# EAGLE schematic SECDONGL_001 (EAGLE 7.7.0)

## Sheet 1 of 3
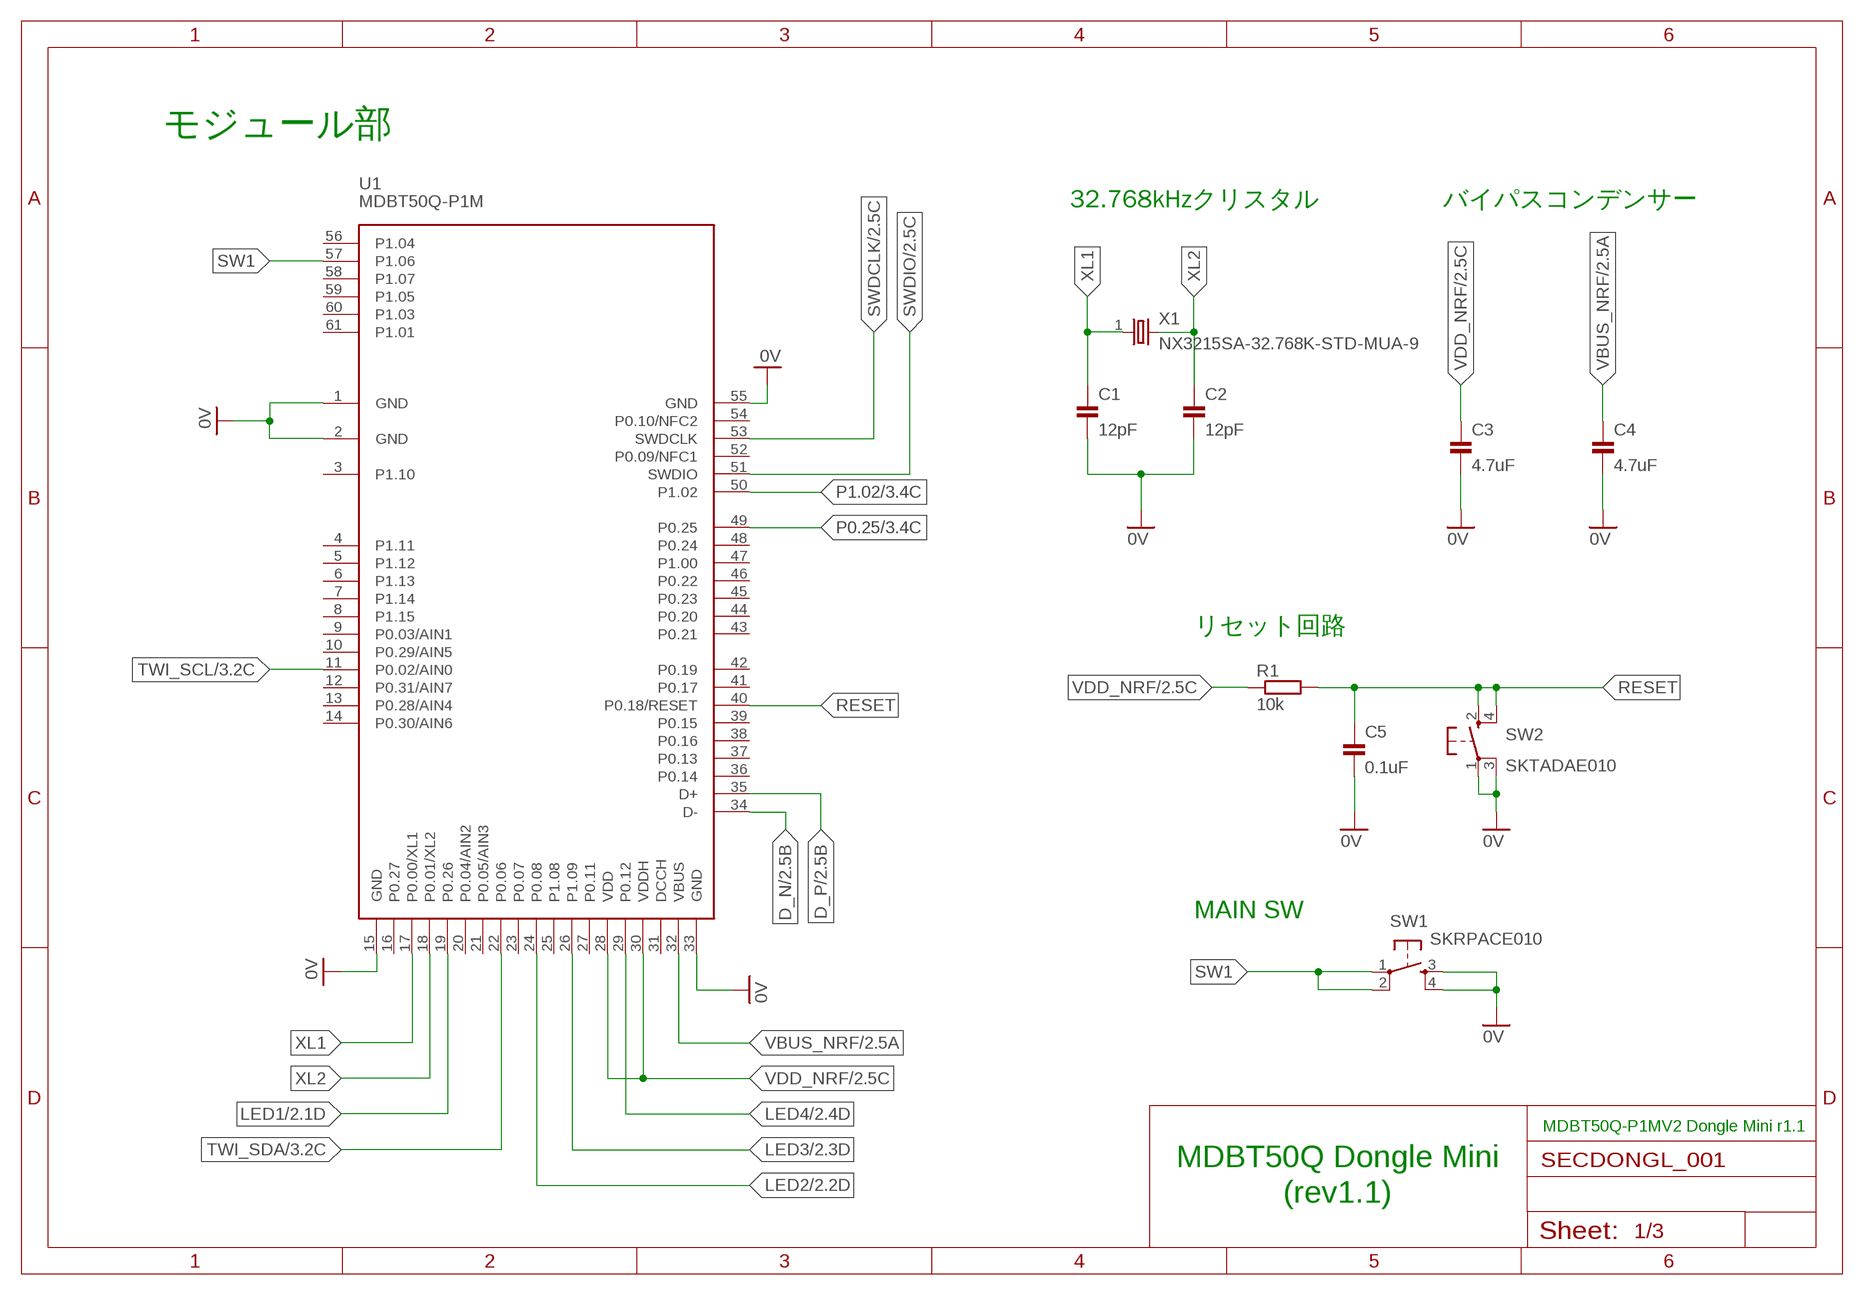
[diagram p0: schematic, sheet 1]

### Parts
C1  12pF  CAP_0603  [C0603K]
C2  12pF  CAP_0603  [C0603K]
C3  4.7uF  CAP_0603  [C0603K]
C4  4.7uF  CAP_0603  [C0603K]
C5  0.1uF  CAP_0402K  [C0402K]
R1  10k  RESISTOR_0402  [R0402]
SW1  SKRPACE010  [SKRPACE010]
SW2  SKTADAE010  [SKTADAE010]
U1  MDBT50Q-P1M  [MDBT50Q-P1M]
X1  NX3215SA-32.768K-STD-MUA-9  [NX3215]

### Nets
0V: C1.2 C2.2 C3.2 C4.2 C5.2 SW1.3(S) SW1.4(S1) SW2.1(P) SW2.3(P1) U1.1(GND) U1.2(GND) U1.15(GND) U1.33(GND) U1.55(GND) ; also sheet 2,3
D_N: U1.34(D-) ; also sheet 2
D_P: U1.35(D+) ; also sheet 2
LED1: U1.19(P0.26) ; also sheet 2
LED2: U1.24(P0.08) ; also sheet 2
LED3: U1.26(P1.09) ; also sheet 2
LED4: U1.29(P0.12) ; also sheet 2
P0.25: U1.49(P0.25) ; also sheet 3
P1.02: U1.50(P1.02) ; also sheet 3
RESET: C5.1 R1.2 SW2.2(S) SW2.4(S1) U1.40(P0.18/RESET)
SW1: SW1.1(P) SW1.2(P1) U1.57(P1.06)
SWDCLK: U1.53(SWDCLK) ; also sheet 2
SWDIO: U1.51(SWDIO) ; also sheet 2
TWI_SCL: U1.11(P0.02/AIN0) ; also sheet 3
TWI_SDA: U1.22(P0.06) ; also sheet 3
VBUS_NRF: C4.1 U1.32(VBUS) ; also sheet 2,3
VDD_NRF: C3.1 R1.1 U1.28(VDD) U1.30(VDDH) ; also sheet 2,3
XL1: C1.1 U1.17(P0.00/XL1) X1.1
XL2: C2.1 U1.18(P0.01/XL2) X1.2
Unconnected: U1.3(P1.10) U1.4(P1.11) U1.5(P1.12) U1.6(P1.13) U1.7(P1.14) U1.8(P1.15) U1.9(P0.03/AIN1) U1.10(P0.29/AIN5) U1.12(P0.31/AIN7) U1.13(P0.28/AIN4) U1.14(P0.30/AIN6) U1.16(P0.27) U1.20(P0.04/AIN2) U1.21(P0.05/AIN3) U1.23(P0.07) U1.25(P1.08) U1.27(P0.11) U1.31(DCCH) U1.36(P0.14) U1.37(P0.13) U1.38(P0.16) U1.39(P0.15) U1.41(P0.17) U1.42(P0.19) U1.43(P0.21) U1.44(P0.20) U1.45(P0.23) U1.46(P0.22) U1.47(P1.00) U1.48(P0.24) U1.52(P0.09/NFC1) U1.54(P0.10/NFC2) U1.56(P1.04) U1.58(P1.07) U1.59(P1.05) U1.60(P1.03) U1.61(P1.01)

### Notes on the sheet
- モジュール部
- 32.768kHzクリスタル | バイパスコンデンサー
- リセット回路
- MAIN SW
- MDBT50Q-P1MV2 Dongle Mini r1.1
- MDBT50Q Dongle Mini
- (rev1.1)

## Sheet 2 of 3
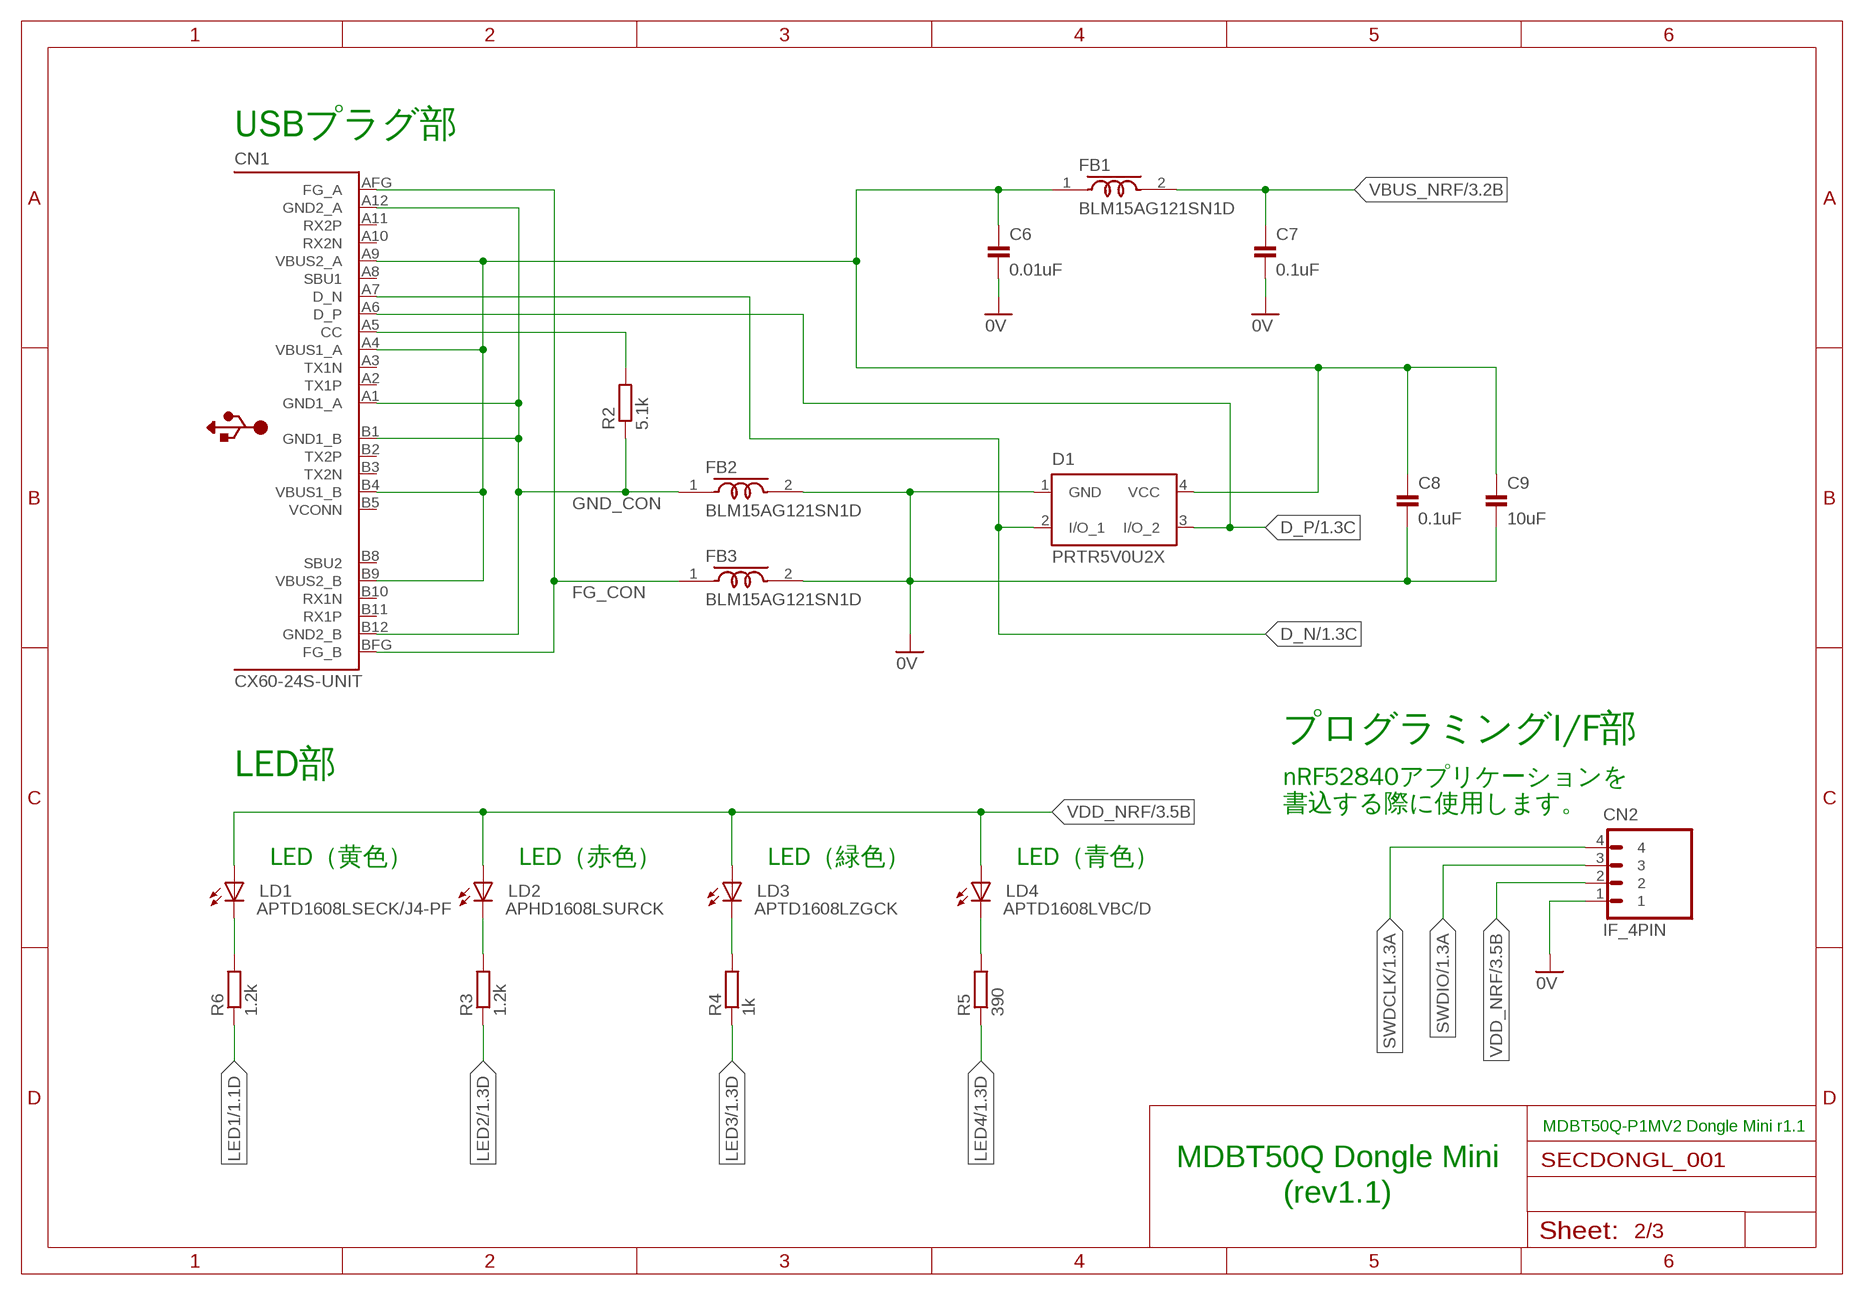
[diagram p1: schematic, sheet 2]

### Parts
C6  0.01uF  CAP_0402K  [C0402K]
C7  0.1uF  CAP_0402K  [C0402K]
C8  0.1uF  CAP_0402K  [C0402K]
C9  10uF  CAP_0603  [C0603K]
CN1  CX60-24S-UNIT  [CX60-24S-UNIT]
CN2  IF_4PIN  [HEADER_4PIN]
D1  PRTR5V0U2X  [SOT143B]
FB1  BLM15AG121SN1D  [C0402K]
FB2  BLM15AG121SN1D  [C0402K]
FB3  BLM15AG121SN1D  [C0402K]
LD1  APTD1608LSECK/J4-PF  [APTD1608]
LD2  APHD1608LSURCK  [APTD1608]
LD3  APTD1608LZGCK  [APTD1608]
LD4  APTD1608LVBC/D  [APTD1608]
R2  5.1k  RESISTOR_0402  [R0402]
R3  1.2k  RESISTOR_0402  [R0402]
R4  1k  RESISTOR_0402  [R0402]
R5  390  RESISTOR_0402  [R0402]
R6  1.2k  RESISTOR_0402  [R0402]

### Nets
0V: C6.2 C7.2 C8.2 C9.2 CN2.1 D1.1(GND) FB2.2 FB3.2 ; also sheet 1,3
D_N: CN1.A7(D_N) D1.2(I/O_1) ; also sheet 1
D_P: CN1.A6(D_P) D1.3(I/O_2) ; also sheet 1
FG_CON: CN1.AFG(FG_A) CN1.BFG(FG_B) FB3.1
GND_CON: CN1.A1(GND1_A) CN1.A12(GND2_A) CN1.B1(GND1_B) CN1.B12(GND2_B) FB2.1 R2.1
LED1: R6.1 ; also sheet 1
LED2: R3.1 ; also sheet 1
LED3: R4.1 ; also sheet 1
LED4: R5.1 ; also sheet 1
N$1: LD4.C R5.2
N$2: CN1.A5(CC) R2.2
N$6: LD3.C R4.2
N$7: LD2.C R3.2
N$8: LD1.C R6.2
SWDCLK: CN2.4 ; also sheet 1
SWDIO: CN2.3 ; also sheet 1
VBUS: C6.1 C8.1 C9.1 CN1.A4(VBUS1_A) CN1.A9(VBUS2_A) CN1.B4(VBUS1_B) CN1.B9(VBUS2_B) D1.4(VCC) FB1.1
VBUS_NRF: C7.1 FB1.2 ; also sheet 1,3
VDD_NRF: CN2.2 LD1.A LD2.A LD3.A LD4.A ; also sheet 1,3
Unconnected: CN1.A2(TX1P) CN1.A3(TX1N) CN1.A8(SBU1) CN1.A10(RX2N) CN1.A11(RX2P) CN1.B2(TX2P) CN1.B3(TX2N) CN1.B5(VCONN) CN1.B8(SBU2) CN1.B10(RX1N) CN1.B11(RX1P)

### Notes on the sheet
- USBプラグ部
- プログラミングI/F部
- LED部
- nRF52840アプリケーションを
  書込する際に使用します。
- LED（黄色） | LED（赤色） | LED（緑色） | LED（青色）
- MDBT50Q-P1MV2 Dongle Mini r1.1
- MDBT50Q Dongle Mini
- (rev1.1)

## Sheet 3 of 3
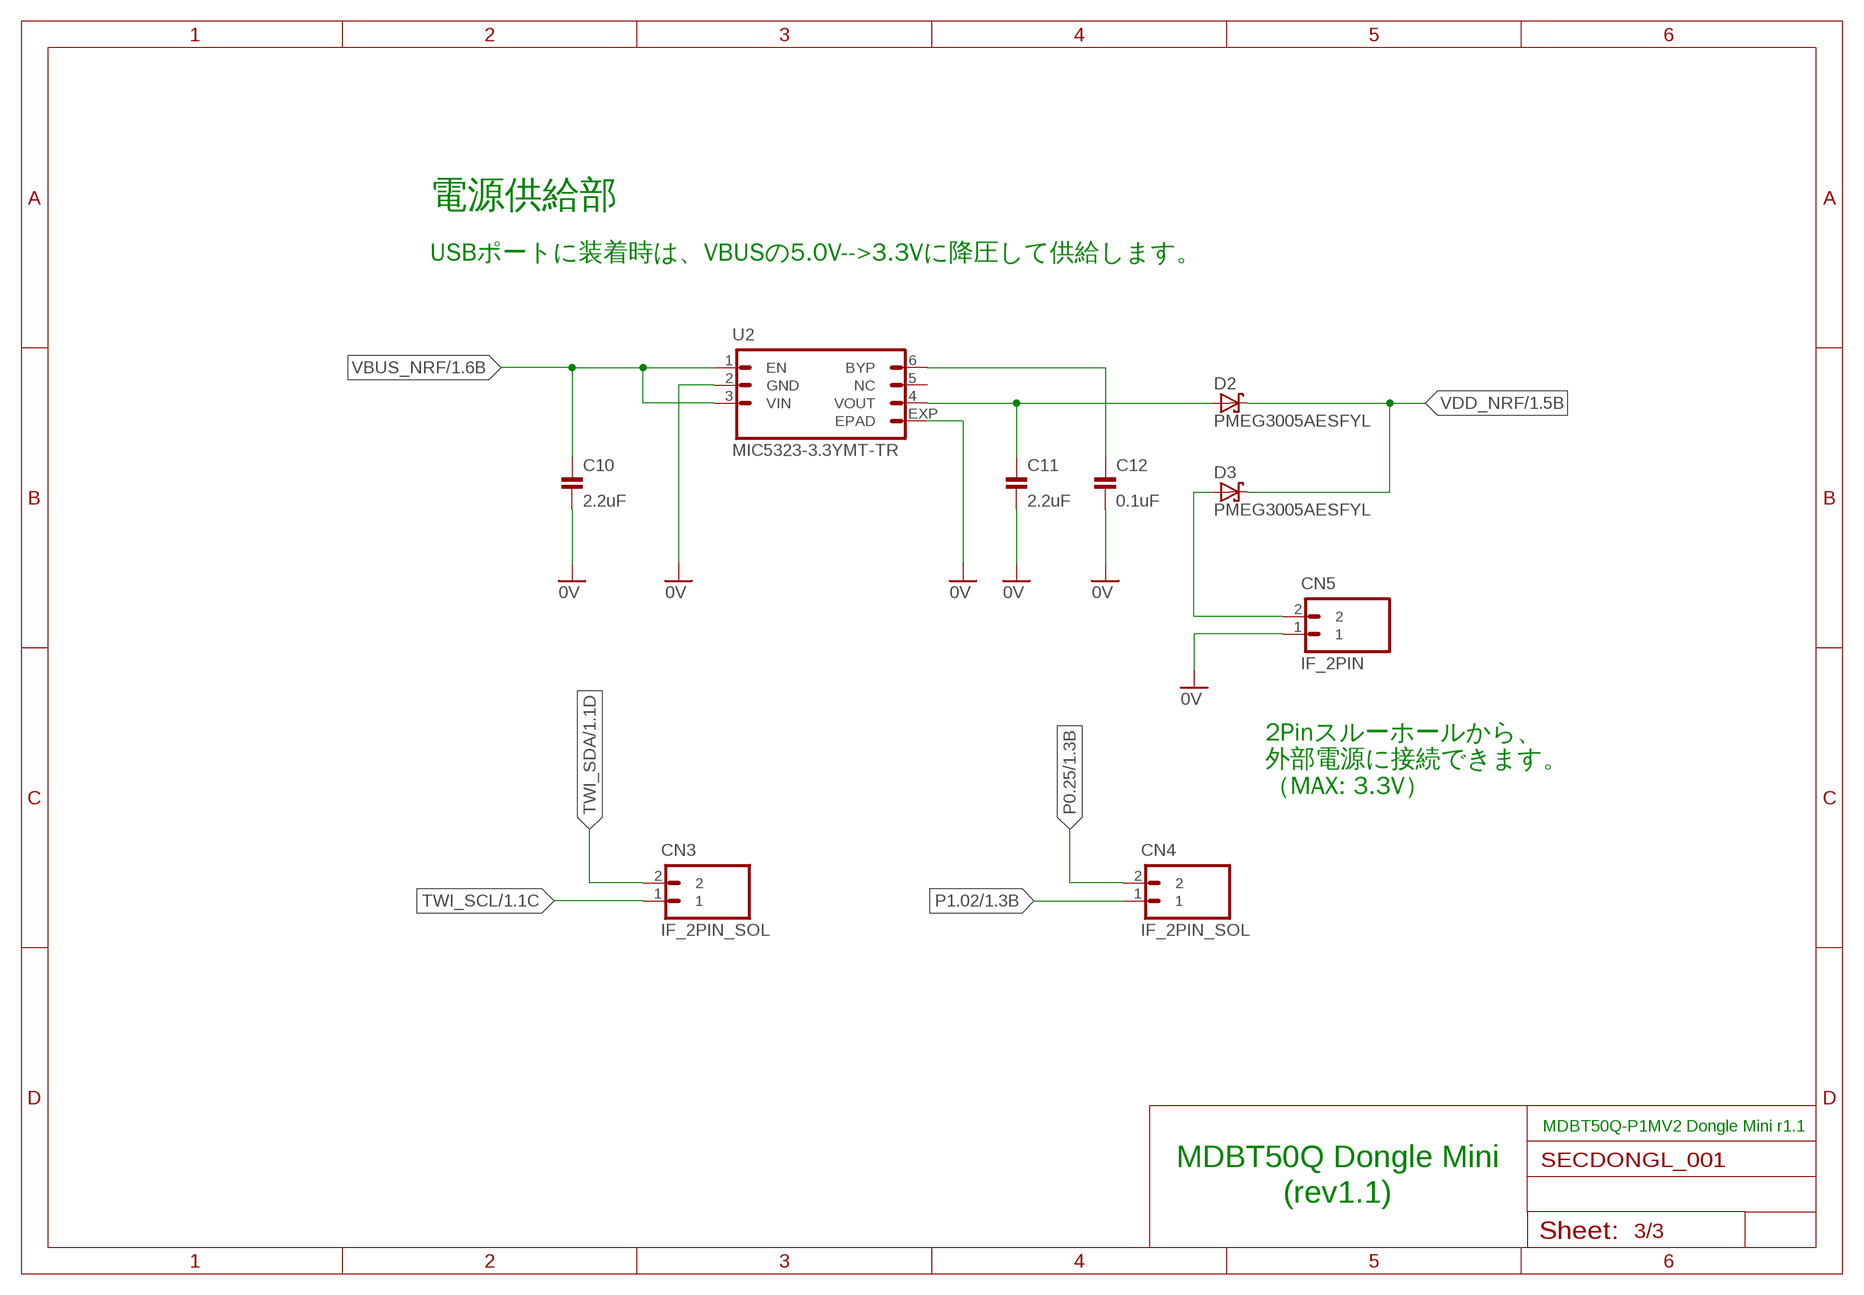
[diagram p2: schematic, sheet 3]

### Parts
C10  2.2uF  CAP_0603  [C0603K]
C11  2.2uF  CAP_0603  [C0603K]
C12  0.1uF  CAP_0402K  [C0402K]
CN3  IF_2PIN_SOL  [SOLPAD_2PIN]
CN4  IF_2PIN_SOL  [SOLPAD_2PIN]
CN5  IF_2PIN  [HEADER_2P]
D2  PMEG3005AESFYL  [SOD962-2]
D3  PMEG3005AESFYL  [SOD962-2]
U2  MIC5323-3.3YMT-TR  [6-VDFN(2X2)]

### Nets
0V: C10.2 C11.2 C12.2 CN5.1 U2.2(GND) U2.EXP(EPAD) ; also sheet 1,2
N$3: CN5.2 D3.A
N$4: C12.1 U2.6(BYP)
N$5: C11.1 D2.A U2.4(VOUT)
P0.25: CN4.2 ; also sheet 1
P1.02: CN4.1 ; also sheet 1
TWI_SCL: CN3.1 ; also sheet 1
TWI_SDA: CN3.2 ; also sheet 1
VBUS_NRF: C10.1 U2.1(EN) U2.3(VIN) ; also sheet 1,2
VDD_NRF: D2.C D3.C ; also sheet 1,2
Unconnected: U2.5(NC)

### Notes on the sheet
- 電源供給部
- USBポートに装着時は、VBUSの5.0V-->3.3Vに降圧して供給します。
- 2Pinスルーホールから、
  外部電源に接続できます。
  （MAX: 3.3V）
- MDBT50Q-P1MV2 Dongle Mini r1.1
- MDBT50Q Dongle Mini
- (rev1.1)

## Library data of the parts
C1-C12 = Parts:CAP: コンデンサー
CN1 = Connectors:CX60-24S-UNIT: USB Type-C(TM) plug
CN2 = Connectors:IF_4PIN: 4-pin インターフェース
CN3-CN5 = Connectors:IF_2PIN: 2-pin インターフェース
D1 = Parts:PRTR5V0U2X: ESD protection diode
D2 D3 = Parts:PMEG3005: ショットキーダイオード If - 順電流: 500 mA Vrrm - 繰返し逆電圧: 30 V Vf - 順電圧: 0.25 V Ifsm - 順方向サージ電流: 4 A 最低動作温度: - 55 C 最高動作温度: + 150 C
FB1-FB3 = Parts:BLM15AG: フェライトビーズ EMIFIL®
LD1 LD3 LD4 = Parts:APTD1608: 発光ダイオード
LD2 = Parts:APHD1608: 発光ダイオード
R1-R6 = Parts:RESISTOR: 抵抗器
SW1 = Parts:SKRPACE010: 表面実装用タクトスイッチ ４．２×３．２ｍｍ小型重作動力タイプ ・作動力：２．５５Ｎ ・操作方向：垂直 ・移動量：０．２ｍｍ ・動作寿命：５０，０００ｃｙｃｌｅｓ （５ｍＡ ５ＶＤＣ） ・初期接触抵抗：最大５００ｍΩ
SW2 = Parts:SKTADAE010: 表面実装用タクトスイッチ 2.6×1.6ｍｍ小型重作動力タイプ ・作動力：2.4 N ・操作方向：垂直 ・移動量：0.11 mm ・定格：50 mA 12 VDC
U1 = Modules:MDBT50Q-P1M: MDBT50Q – P1M (PCB Antenna) Bluetooth 5, IEEE 802.15.4, 2.4 GHz transceiver ARM Cortex –M4 32-bit processor with FPU, 64 MHz Memory: 1MB flash / 256KB RAM ‧Supply voltage range 1.7V to 5.5V ‧On-chip DC/DC and LDO regulators with automated low current modes ‧Regulated supply for external components from 1.8V to 3.3V ‧0.4uA at 3V in System OFF mode, no RAM retention ‧1.5uA at 3V in System ON mode, no RAM retention, wake on RTC Working distance 1Mbps: up to 250 meters in open space 2Mbps: up to 120 meters in open space
U2 = ICs:MIC5323: Ultra-Low Dropout LDO Regulator 電圧 - 入力（最大）：5.5V 電圧 - 出力（最小/固定）：3.3V 電流 - 出力：500mA 動作温度：-40°C～125°C
X1 = Parts:NX3215SA: 水晶振動子 周波数 32.768kHz 周波数公差 ±20ppm 負荷容量 6pF ESR（等価直列抵抗） 70 kOhms 動作温度 -40°C～85°C